# EAGLE schematic boardShildSchematicbackup (EAGLE 6.6.0)
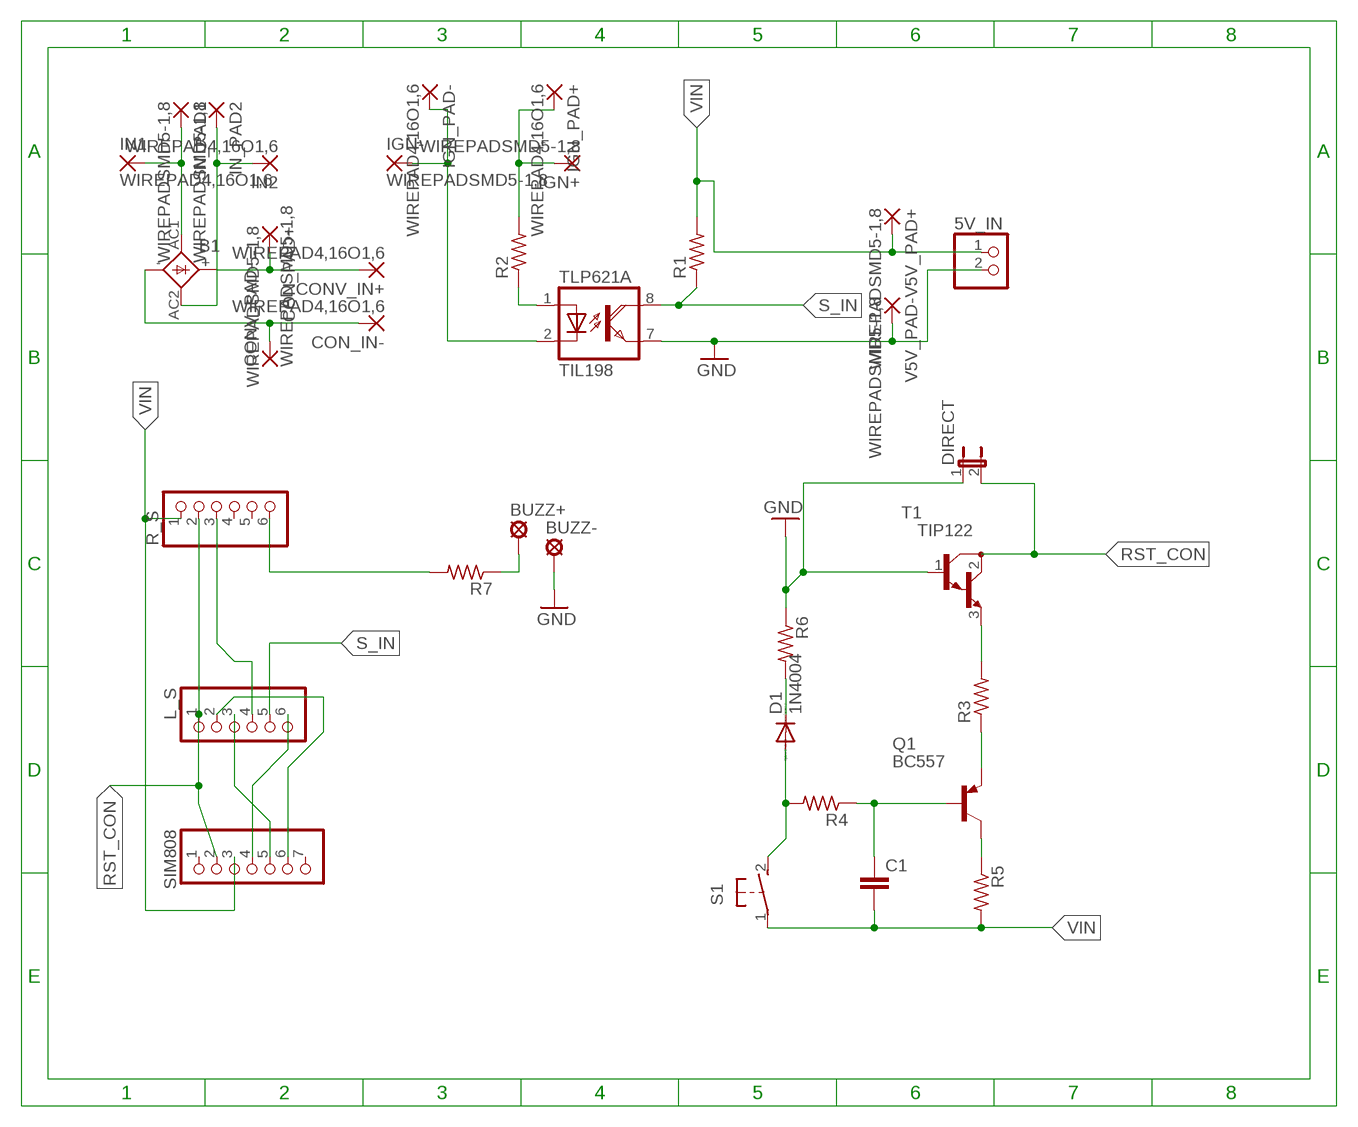
[diagram p0: schematic, sheet 1]

## Parts
5V_IN  PINHD-1X2  [1X02]
B1  FB15  [FB15]
BUZZ+  LSP10  [LSP10]
BUZZ-  LSP10  [LSP10]
C1  C2.5/5  [C2.5-5]
CON_IN-  WIREPAD4,16O1,6  [4,16O1,6]
CON_PAD+  WIREPADSMD5-1,8  [5-1,8]
CONV_IN+  WIREPAD4,16O1,6  [4,16O1,6]
CONV_PAD-  WIREPADSMD5-1,8  [5-1,8]
D1  1N4004  [DO41-10]
DIRECT  JP1E  [JP1]
IGN+  WIREPADSMD5-1,8  [5-1,8]
IGN-  WIREPADSMD5-1,8  [5-1,8]
IGN_PAD+  WIREPAD4,16O1,6  [4,16O1,6]
IGN_PAD-  WIREPAD4,16O1,6  [4,16O1,6]
IN1  WIREPAD4,16O1,6  [4,16O1,6]
IN2  WIREPAD4,16O1,6  [4,16O1,6]
IN_PAD1  WIREPADSMD5-1,8  [5-1,8]
IN_PAD2  WIREPADSMD5-1,8  [5-1,8]
L_S  PINHD-1X6  [1X06]
Q1  BC557  [TO92]
R1  R-US_0204/5  [0204/5]
R2  R-US_0204/5  [0204/5]
R3  R-US_0204/5  [0204/5]
R4  R-US_0204/5  [0204/5]
R5  R-US_0204/5  [0204/5]
R6  R-US_0204/5  [0204/5]
R7  R-US_0204/5  [0204/5]
R_S  PINHD-1X6  [1X06]
S1  31-XX  [B3F-31XX]
SIM808  PINHD-1X7  [1X07]
T1  TIP122  [TO220]
TLP621  TIL198  [DIL08]
V5V_PAD+  WIREPADSMD5-1,8  [5-1,8]
V5V_PAD-  WIREPADSMD5-1,8  [5-1,8]

## Nets
GND: 5V_IN.2 BUZZ-.MP DIRECT.1 R6.1 T1.1(B) TLP621.7(A:EMI) V5V_PAD-.1(P)
N$1: R2.1 TLP621.1(A:A)
N$2: B1.AC1 IN1.1(P) IN_PAD1.1(P)
N$3: IGN+.1(P) IGN_PAD+.1(P) R2.2
N$4: L_S.4 R_S.3
N$5: L_S.2 SIM808.6
N$7: B1.- CON_IN-.1(P) CONV_PAD-.1(P)
N$8: L_S.3 SIM808.5
N$9: L_S.6 SIM808.4
N$10: IGN-.1(P) IGN_PAD-.1(P) TLP621.2(A:C)
N$11: BUZZ+.MP R7.1
N$12: B1.AC2 IN2.1(P) IN_PAD2.1(P)
N$13: D1.A R4.2 S1.2(S)
N$14: C1.1 Q1.2(B) R4.1
N$15: B1.+ CON_PAD+.1(P) CONV_IN+.1(P)
N$16: Q1.3(C) R5.1
N$17: Q1.1(E) R3.1
N$18: D1.C R6.2
N$19: R7.2 R_S.6
N$20: R3.2 T1.3(E)
RST_CON: DIRECT.2 L_S.1 R_S.2 SIM808.2 T1.2(C)
S_IN: L_S.5 R1.1 TLP621.8(A:COL)
VIN: 5V_IN.1 C1.2 R1.2 R5.2 R_S.1 S1.1(P) SIM808.3 V5V_PAD+.1(P)
Unconnected: R_S.4 R_S.5 SIM808.1 SIM808.7 TLP621.3(B:A) TLP621.4(B:C) TLP621.5(B:EMI) TLP621.6(B:COL)

## Library data of the parts
5V_IN = pinhead:PINHD-1X2: PIN HEADER
B1 = rectifier:FB15: FAGOR RECTIFIER grid 3 x 5 mm
BUZZ+ BUZZ- = solpad:LSP10: SOLDER PAD drill 1.0 mm, distributor Buerklin, 12H555
C1 = capacitor-wima:C: CAPACITOR naming: grid - package width
CON_IN- CON_PAD+ CONV_IN+ CONV_PAD- IGN+ IGN- IGN_PAD+ IGN_PAD- IN1 IN2 IN_PAD1 IN_PAD2 V5V_PAD+ V5V_PAD- = wirepad:WIREPAD: Wire PAD connect wire on PCB
D1 = diode:1N4004: DIODE general purpose rectifier, 1 A
DIRECT = jumper:JP1E: JUMPER
L_S R_S = pinhead:PINHD-1X6: PIN HEADER
Q1 = transistor-pnp:BC557: PNP Transistor
R1-R7 = rcl:R-US_: RESISTOR, American symbol
S1 = switch-omron:31-XX: OMRON SWITCH; MPN: B3F-3100; OC_FARNELL: 959704; OC_NEWARK: 36M3582
SIM808 = pinhead:PINHD-1X7: PIN HEADER
T1 = transistor:TIP122: NPN BIPOLAR DARLINGTON TRANSISTOR
TLP621 = optocoupler:TIL198: TEXAS INSTRUMENTS OPTO COUPLER; OC_FARNELL: unknown; OC_NEWARK: unknown